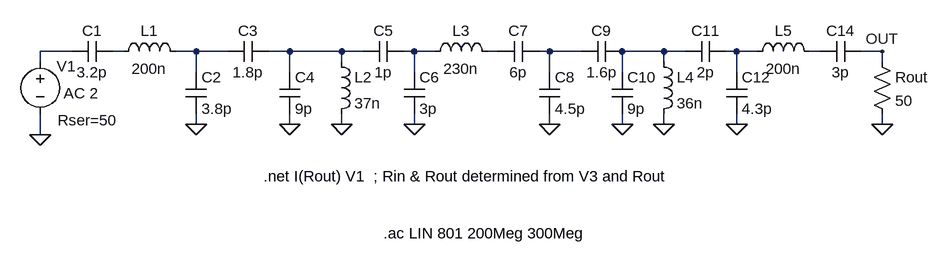
[diagram p0: schematic S-param.asc]
S-param.asc, the LTspice schematic file:
Version 4
SHEET 1 2384 1052
WIRE 160 176 160 160
WIRE 160 288 160 256
WIRE 208 160 160 160
WIRE 288 160 272 160
WIRE 400 160 368 160
WIRE 400 192 400 160
WIRE 400 272 400 256
WIRE 448 160 400 160
WIRE 544 160 512 160
WIRE 544 192 544 160
WIRE 544 272 544 256
WIRE 624 160 544 160
WIRE 624 176 624 160
WIRE 624 272 624 256
WIRE 656 160 624 160
WIRE 736 160 720 160
WIRE 736 192 736 160
WIRE 736 272 736 256
WIRE 768 160 736 160
WIRE 864 160 848 160
WIRE 944 160 928 160
WIRE 944 192 944 160
WIRE 944 272 944 256
WIRE 992 160 944 160
WIRE 1056 192 1056 160
WIRE 1056 272 1056 256
WIRE 1120 160 1056 160
WIRE 1120 176 1120 160
WIRE 1120 272 1120 256
WIRE 1152 160 1120 160
WIRE 1232 160 1216 160
WIRE 1232 192 1232 160
WIRE 1232 272 1232 256
WIRE 1264 160 1232 160
WIRE 1360 160 1344 160
WIRE 1456 160 1424 160
WIRE 1456 176 1456 160
WIRE 1456 272 1456 256
FLAG 160 288 0
FLAG 1456 272 0
FLAG 1456 160 OUT
FLAG 400 272 0
FLAG 544 272 0
FLAG 624 272 0
FLAG 736 272 0
FLAG 944 272 0
FLAG 1056 272 0
FLAG 1120 272 0
FLAG 1232 272 0
SYMBOL res 1440 160 R0
SYMATTR InstName Rout
SYMATTR Value 50
SYMBOL voltage 160 160 R0
WINDOW 0 25 23 Left 0
WINDOW 3 25 93 Left 0
WINDOW 123 36 64 Left 0
WINDOW 39 27 106 Left 0
SYMATTR InstName V1
SYMATTR Value ""
SYMATTR Value2 AC 2
SYMATTR SpiceLine Rser=50
SYMBOL cap 208 144 M90
WINDOW 0 0 32 VBottom 0
WINDOW 3 32 32 VTop 0
SYMATTR InstName C1
SYMATTR Value 3.2p
SYMBOL ind 272 176 R270
WINDOW 0 32 56 VTop 0
WINDOW 3 5 56 VBottom 0
SYMATTR InstName L1
SYMATTR Value 200n
SYMBOL cap 384 192 R0
SYMATTR InstName C2
SYMATTR Value 3.8p
SYMBOL cap 448 144 M90
WINDOW 0 0 32 VBottom 0
WINDOW 3 32 32 VTop 0
SYMATTR InstName C3
SYMATTR Value 1.8p
SYMBOL cap 528 192 R0
SYMATTR InstName C4
SYMATTR Value 9p
SYMBOL ind 608 160 R0
SYMATTR InstName L2
SYMATTR Value 37n
SYMBOL cap 656 144 M90
WINDOW 0 0 32 VBottom 0
WINDOW 3 32 32 VTop 0
SYMATTR InstName C5
SYMATTR Value 1p
SYMBOL cap 720 192 R0
SYMATTR InstName C6
SYMATTR Value 3p
SYMBOL ind 752 176 R270
WINDOW 0 32 56 VTop 0
WINDOW 3 5 56 VBottom 0
SYMATTR InstName L3
SYMATTR Value 230n
SYMBOL cap 864 144 M90
WINDOW 0 0 32 VBottom 0
WINDOW 3 32 32 VTop 0
SYMATTR InstName C7
SYMATTR Value 6p
SYMBOL cap 928 192 R0
SYMATTR InstName C8
SYMATTR Value 4.5p
SYMBOL cap 992 144 M90
WINDOW 0 0 32 VBottom 0
WINDOW 3 32 32 VTop 0
SYMATTR InstName C9
SYMATTR Value 1.6p
SYMBOL cap 1040 192 R0
SYMATTR InstName C10
SYMATTR Value 9p
SYMBOL ind 1104 160 R0
SYMATTR InstName L4
SYMATTR Value 36n
SYMBOL cap 1152 144 M90
WINDOW 0 0 32 VBottom 0
WINDOW 3 32 32 VTop 0
SYMATTR InstName C11
SYMATTR Value 2p
SYMBOL cap 1216 192 R0
SYMATTR InstName C12
SYMATTR Value 4.3p
SYMBOL ind 1248 176 R270
WINDOW 0 32 56 VTop 0
WINDOW 3 5 56 VBottom 0
SYMATTR InstName L5
SYMATTR Value 200n
SYMBOL cap 1360 144 M90
WINDOW 0 0 32 VBottom 0
WINDOW 3 32 32 VTop 0
SYMATTR InstName C14
SYMATTR Value 3p
TEXT 688 440 Left 0 !.ac LIN 801 200Meg 300Meg
TEXT 504 352 Left 0 !.net I(Rout) V1  ; Rin & Rout determined from V3 and Rout

The netlist it stands for:
* S-param.asc
Rout OUT 0 50
V1 N001 0 AC 2 Rser=50
C1 N001 N002 3.2p
L1 N002 N003 200n
C2 N003 0 3.8p
C3 N003 N004 1.8p
C4 N004 0 9p
L2 N004 0 37n
C5 N004 N005 1p
C6 N005 0 3p
L3 N005 N006 230n
C7 N006 N007 6p
C8 N007 0 4.5p
C9 N007 N008 1.6p
C10 N008 0 9p
L4 N008 0 36n
C11 N008 N009 2p
C12 N009 0 4.3p
L5 N009 N010 200n
C14 N010 OUT 3p
.ac LIN 801 200Meg 300Meg
.net I(Rout) V1  ; Rin & Rout determined from V3 and Rout
.backanno
.end